# Altium schematic sheet hex_inverter.SchDoc
size A4; SheetNumber: 2; SheetTotal: 2
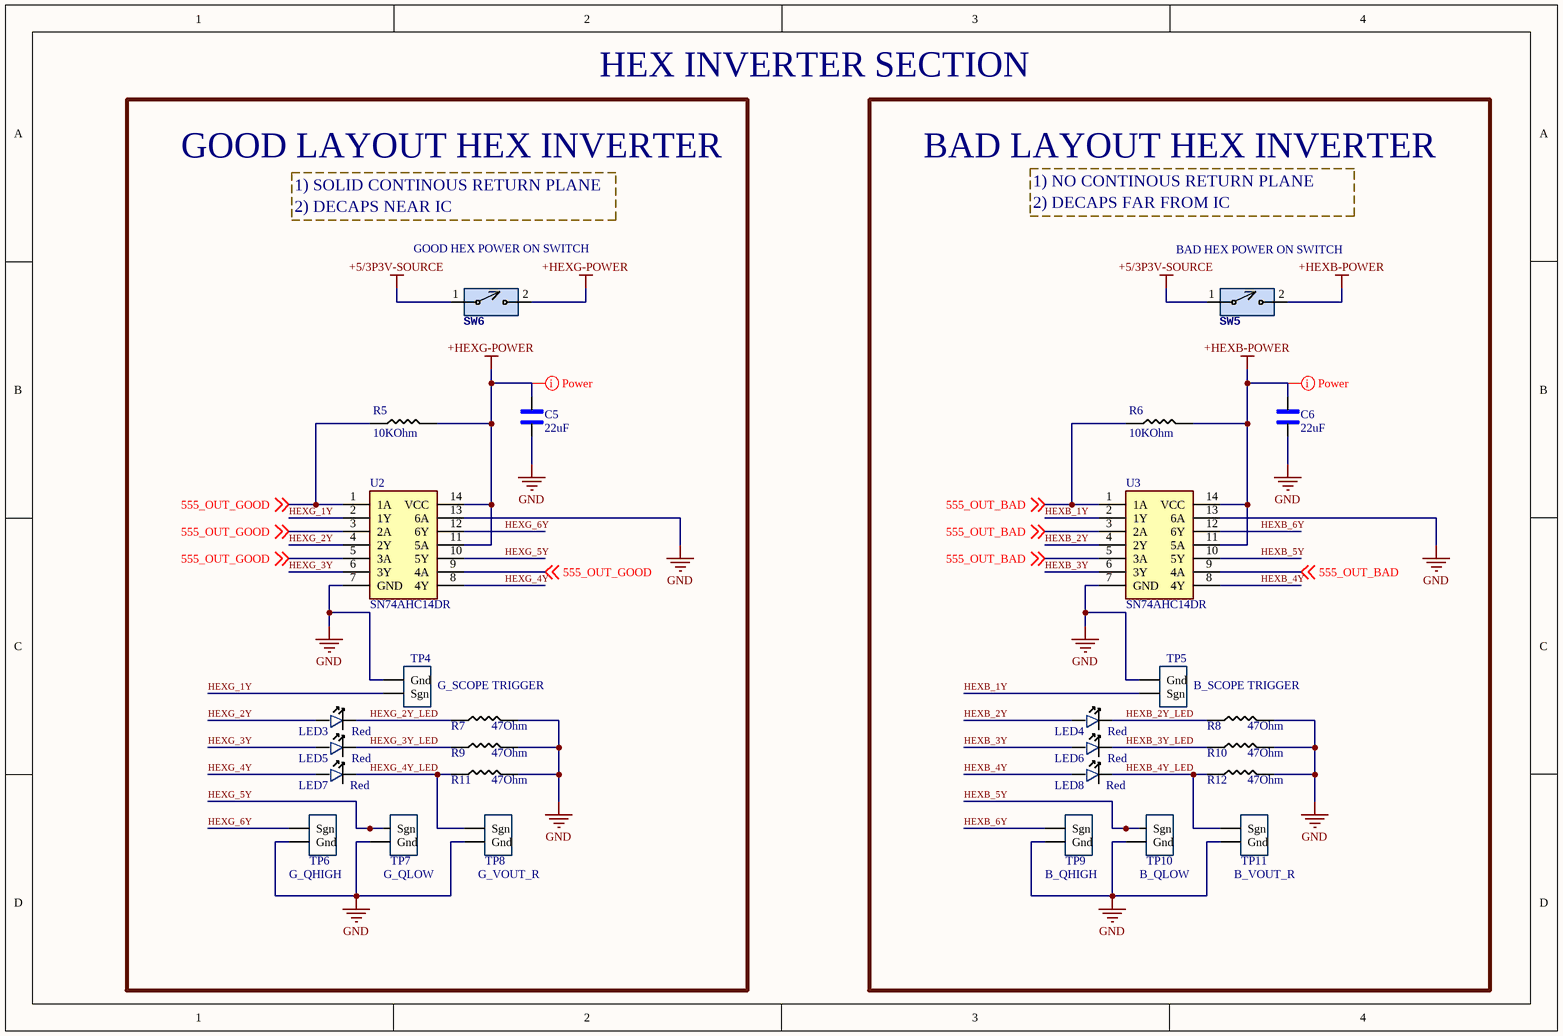
[diagram p0: hex_inverter.SchDoc]

## Parts
C5  22uF  [1206_Passive_Capacitor]
C6  22uF  [1206_Passive_Capacitor]
LED3  Red  [LED_1206]
LED4  Red  [LED_1206]
LED5  Red  [LED_1206]
LED6  Red  [LED_1206]
LED7  Red  [LED_1206]
LED8  Red  [LED_1206]
R5  value 10KOhm  [1206_Passive_Resitor]  (hidden comment: 10k)
R6  value 10KOhm  [1206_Passive_Resitor]  (hidden comment: 10k)
R7  value 47Ohm  [1206_Passive_Resitor]  (hidden comment: 47 Ohms)
R8  value 47Ohm  [1206_Passive_Resitor]  (hidden comment: 47 Ohms)
R9  value 47Ohm  [1206_Passive_Resitor]  (hidden comment: 47 Ohms)
R10  value 47Ohm  [1206_Passive_Resitor]  (hidden comment: 47 Ohms)
R11  value 47Ohm  [1206_Passive_Resitor]  (hidden comment: 47 Ohms)
R12  value 47Ohm  [1206_Passive_Resitor]  (hidden comment: 47 Ohms)
SW5  SW_2Pin_100mil_Switch  [2Pin-Header-Conn]  (value not drawn)
SW6  SW_2Pin_100mil_Switch  [2Pin-Header-Conn]  (value not drawn)
TP4  10x Probe TP  [TP10x_Probe]  (value not drawn)
TP5  10x Probe TP  [TP10x_Probe]  (value not drawn)
TP6  10x Probe TP  [TP10x_Probe]  (value not drawn)
TP7  10x Probe TP  [TP10x_Probe]  (value not drawn)
TP8  10x Probe TP  [TP10x_Probe]  (value not drawn)
TP9  10x Probe TP  [TP10x_Probe]  (value not drawn)
TP10  10x Probe TP  [TP10x_Probe]  (value not drawn)
TP11  10x Probe TP  [TP10x_Probe]  (value not drawn)
U2  SN74AHC14DR  [HEX_74AC14]
U3  SN74AHC14DR  [HEX_74AC14]

## Blocks framed on the sheet
BAD LAYOUT HEX INVERTER: C6 LED4 LED6 LED8 R6 R8 R10 R12 SW5 TP5 TP9-TP11 U3

## Nets
+5/3P3V-SOURCE: SW5.1 SW6.1
+HEXB-POWER: C6.2 R6.2 SW5.2 U3.11(5A) U3.14(VCC)
+HEXG-POWER: C5.2 R5.2 SW6.2 U2.11(5A) U2.14(VCC)
GND: C5.1 C6.1 R7.2 R8.2 R9.2 R10.2 R11.2 R12.2 TP4.2(Gnd) TP5.2(Gnd) TP6.2(Gnd) TP7.2(Gnd) TP8.2(Gnd) TP9.2(Gnd) TP10.2(Gnd) TP11.2(Gnd) U2.7(GND) U2.13(6A) U3.7(GND) U3.13(6A)
555_OUT_BAD: R6.1 U3.1(1A) U3.3(2A) U3.5(3A) U3.9(4A) ; off-sheet 555_OUT_BAD
555_OUT_GOOD: R5.1 U2.1(1A) U2.3(2A) U2.5(3A) U2.9(4A) ; off-sheet 555_OUT_GOOD
HEXB_1Y: TP5.1(Sgn) U3.2(1Y)
HEXB_2Y: LED4.1 U3.4(2Y)
HEXB_2Y_LED: LED4.2 R8.1
HEXB_3Y: LED6.1 U3.6(3Y)
HEXB_3Y_LED: LED6.2 R10.1
HEXB_4Y: LED8.1 U3.8(4Y)
HEXB_4Y_LED: LED8.2 R12.1 TP11.1(Sgn)
HEXB_5Y: TP10.1(Sgn) U3.10(5Y)
HEXB_6Y: TP9.1(Sgn) U3.12(6Y)
HEXG_1Y: TP4.1(Sgn) U2.2(1Y)
HEXG_2Y: LED3.1 U2.4(2Y)
HEXG_2Y_LED: LED3.2 R7.1
HEXG_3Y: LED5.1 U2.6(3Y)
HEXG_3Y_LED: LED5.2 R9.1
HEXG_4Y: LED7.1 U2.8(4Y)
HEXG_4Y_LED: LED7.2 R11.1 TP8.1(Sgn)
HEXG_5Y: TP7.1(Sgn) U2.10(5Y)
HEXG_6Y: TP6.1(Sgn) U2.12(6Y)

## Layout directives
rule Width Constraint [Pref Width = 20mil    Min Width = 15mil    Max Width = 100mil]: +HEXB-POWER, +HEXG-POWER

## Notes on the sheet
- HEX INVERTER SECTION
- GOOD LAYOUT HEX INVERTER
- 1) SOLID CONTINOUS RETURN PLANE
- 2) DECAPS NEAR IC
- 1) NO CONTINOUS RETURN PLANE
- 2) DECAPS FAR FROM IC
- (near SW6) GOOD HEX POWER ON SWITCH
- (near SW5) BAD HEX POWER ON SWITCH
- G_SCOPE TRIGGER
- B_SCOPE TRIGGER
- (near TP6) G_QHIGH
- (near TP7) G_QLOW
- (near TP8) G_VOUT_R
- (near TP9) B_QHIGH
- (near TP10) B_QLOW
- (near TP11) B_VOUT_R

## Library data of the parts
C5 C6 = C_22uF_1206: 22uF ±10% 25V X5R 1206 Multilayer Ceramic Capacitors MLCC - SMD/SMT RoHS; MFR Part #: CL31A226KAHNNNE; Type: basic; LCSC Part#: C12891; Datasheet: https://datasheet.lcsc.com/lcsc/1811031514_Samsung-Electro-Mechanics-CL31A226KAHNNNE_C12891.pdf; Value: 22uF
LED3-LED8 = LED_RED_1206: Red 621~631nm 1206 Light Emitting Diodes (LED) RoHS; MFR Part #: 15-21/R6C-FQ1R1B/2T; Type: Extended; LCSC Part#: C93133; Datasheet: https://datasheet.lcsc.com/szlcsc/1811151241_Everlight-Elec-15-21-R6C-FQ1R1B-2T_C93133.pdf; Value: Red
R5 R6 = R_10KOhm_1206: 10 kOhms ±5% 0.25W, 1/4W Chip Resistor 1206 (3216 Metric) Automotive AEC-Q200 Thick Film; MFR Part #: RMCF1206FT10K0; Digikey Link: https://www.digikey.com/en/products/detail/stackpole-electronics-inc/RMCF1206FT10K0/1759669; LCSC Part#: C17902; Type: Basic
R7-R12 = R_47Ohm_1206: 47Ω ±5% 0.25W ±200ppm/℃ 1206 Chip Resistor - Surface Mount RoHS; MFR Part #: 1206W4J0470T5E; LCSC Part#: C25384; Type: Extended; Datasheet: https://datasheet.lcsc.com/lcsc/1811101020_UNI-ROYAL-Uniroyal-Elec-1206W4J0470T5E_C25384.pdf
SW5 SW6 = SW_2Pin_100mil_Switch: 2Pin Header; LCSC Part#: C124375; Type: Extended
TP4-TP11 = TP_10x_Probe: Test Point 300 mil centers
U2 U3 = U_74AHC14: Inverter IC 6 Channel Schmitt Trigger 14-SOIC; Datasheet: https://datasheet.lcsc.com/szlcsc/ON-Semicon-ON-74AC14SCX_C5482.pdf; MFR Part #: SN74AHC14DR; LCSC Part#: C6942; Type: Extended